# Altium schematic sheet PROM.SchDoc
size Tabloid; SheetNumber: 10; SheetTotal: 25; Sheet_Name: PROM; Size: 11x17
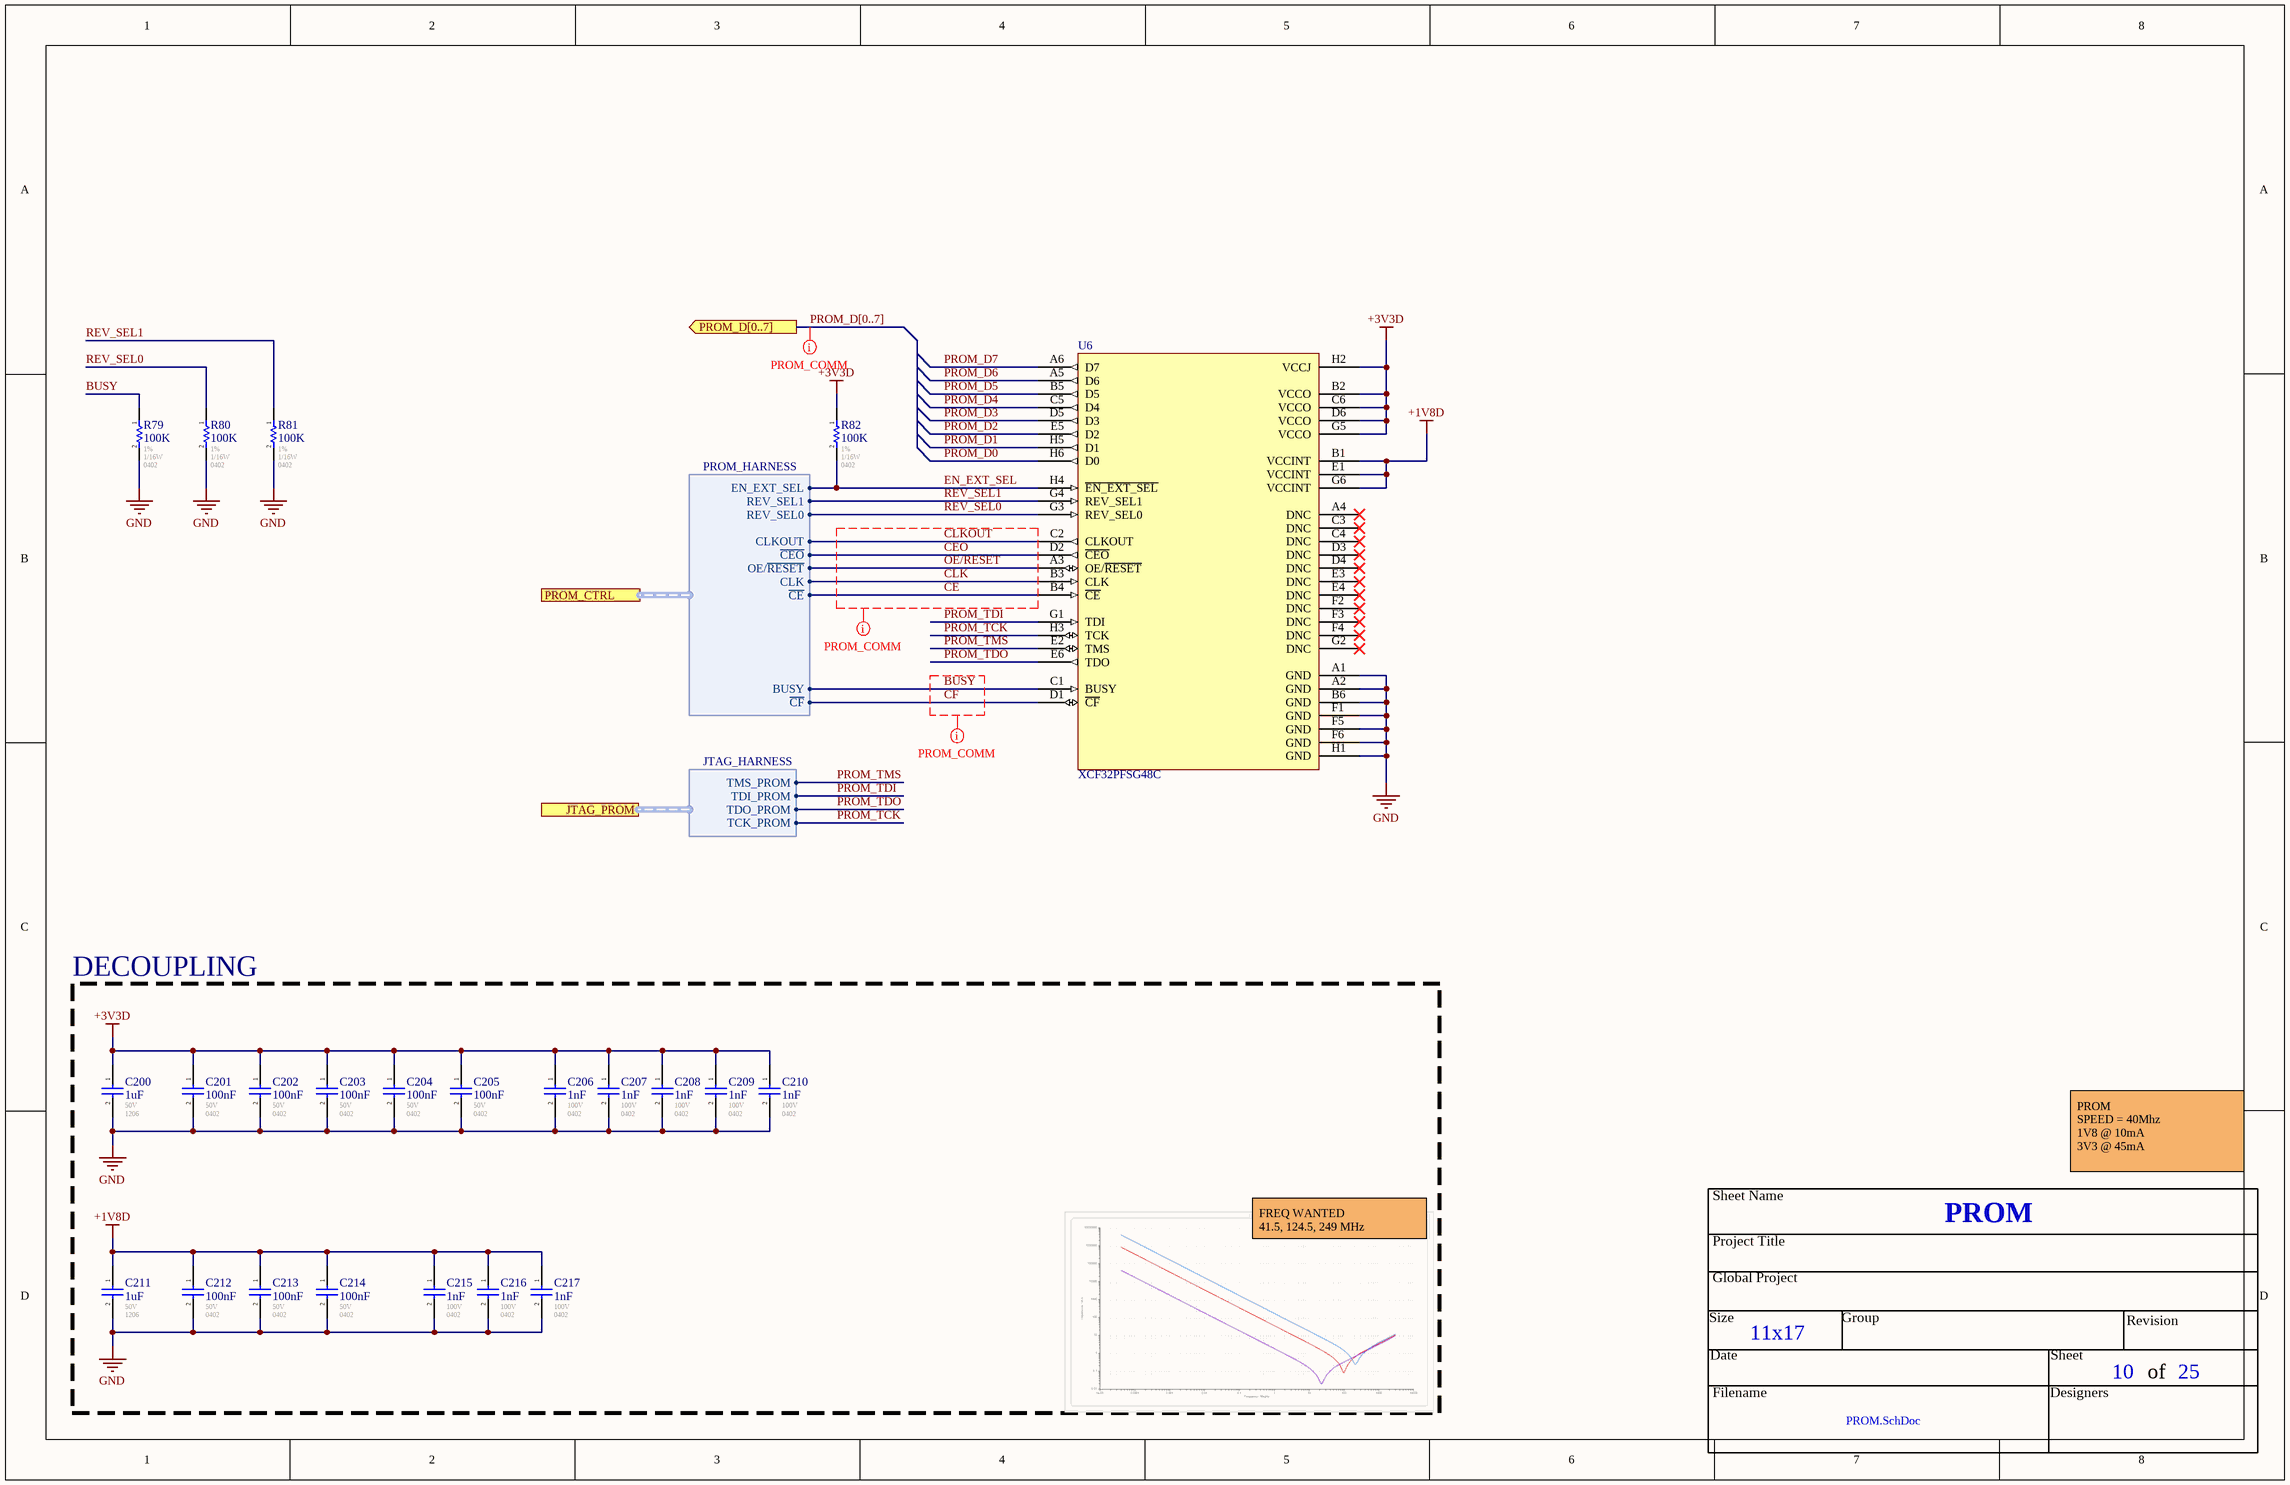
[diagram p0: PROM.SchDoc]

## Parts
C200  1uF  Voltage - Rated: 50V  Footprint: 1206  [CAP_1206]
C201  100nF  Voltage - Rated: 50V  Footprint: 0402  [CAP_0402]
C202  100nF  Voltage - Rated: 50V  Footprint: 0402  [CAP_0402]
C203  100nF  Voltage - Rated: 50V  Footprint: 0402  [CAP_0402]
C204  100nF  Voltage - Rated: 50V  Footprint: 0402  [CAP_0402]
C205  100nF  Voltage - Rated: 50V  Footprint: 0402  [CAP_0402]
C206  1nF  Voltage - Rated: 100V  Footprint: 0402  [CAP_0402]
C207  1nF  Voltage - Rated: 100V  Footprint: 0402  [CAP_0402]
C208  1nF  Voltage - Rated: 100V  Footprint: 0402  [CAP_0402]
C209  1nF  Voltage - Rated: 100V  Footprint: 0402  [CAP_0402]
C210  1nF  Voltage - Rated: 100V  Footprint: 0402  [CAP_0402]
C211  1uF  Voltage - Rated: 50V  Footprint: 1206  [CAP_1206]
C212  100nF  Voltage - Rated: 50V  Footprint: 0402  [CAP_0402]
C213  100nF  Voltage - Rated: 50V  Footprint: 0402  [CAP_0402]
C214  100nF  Voltage - Rated: 50V  Footprint: 0402  [CAP_0402]
C215  1nF  Voltage - Rated: 100V  Footprint: 0402  [CAP_0402]
C216  1nF  Voltage - Rated: 100V  Footprint: 0402  [CAP_0402]
C217  1nF  Voltage - Rated: 100V  Footprint: 0402  [CAP_0402]
R79  100K  Tolerance: 1%  Power: 1/16W  Package / Case: 0402  [RES_0402]
R80  100K  Tolerance: 1%  Power: 1/16W  Package / Case: 0402  [RES_0402]
R81  100K  Tolerance: 1%  Power: 1/16W  Package / Case: 0402  [RES_0402]
R82  100K  Tolerance: 1%  Power: 1/16W  Package / Case: 0402  [RES_0402]
U6  XCF32PFSG48C  [TFBGA-48_0.8MM_8X9]

## Blocks framed on the sheet
DECOUPLING: C200-C217

## Ports
JTAG_PROM (harness JTAG_HARNESS), PROM_CTRL (harness PROM_HARNESS), PROM_D[0..7] (out)

## Harnesses
PROM_HARNESS: EN_EXT_SEL, REV_SEL1, REV_SEL0, CLKOUT, ~{CEO}, OE/~{RESET}, CLK, ~{CE}, BUSY, ~{CF}
JTAG_HARNESS: TCK_PROM, TDO_PROM, TDI_PROM, TMS_PROM

## Nets
+1V8D: C211.1 C212.1 C213.1 C214.1 C215.1 C216.1 C217.1 U6.B1(VCCINT) U6.E1(VCCINT) U6.G6(VCCINT)
+3V3D: C200.1 C201.1 C202.1 C203.1 C204.1 C205.1 C206.1 C207.1 C208.1 C209.1 C210.1 R82.1 U6.B2(VCCO) U6.C6(VCCO) U6.D6(VCCO) U6.G5(VCCO) U6.H2(VCCJ)
GND: C200.2 C201.2 C202.2 C203.2 C204.2 C205.2 C206.2 C207.2 C208.2 C209.2 C210.2 C211.2 C212.2 C213.2 C214.2 C215.2 C216.2 C217.2 R79.2 R80.2 R81.2 U6.A1(GND) U6.A2(GND) U6.B6(GND) U6.F1(GND) U6.F5(GND) U6.F6(GND) U6.H1(GND)
~{CE}: U6.B4(~{CE}) ; port PROM_CTRL.~{CE}
~{CEO}: U6.D2(~{CEO}) ; port PROM_CTRL.~{CEO}
~{CF}: U6.D1(~{CF}) ; port PROM_CTRL.~{CF}
BUSY: R79.1 U6.C1(BUSY) ; port PROM_CTRL.BUSY
CLK: U6.B3(CLK) ; port PROM_CTRL.CLK
CLKOUT: U6.C2(CLKOUT) ; port PROM_CTRL.CLKOUT
EN_EXT_SEL: R82.2 U6.H4(~{EN_EXT_SEL}) ; port PROM_CTRL.EN_EXT_SEL
OE/RESET: U6.A3(OE/~{RESET}) ; port PROM_CTRL.OE/~{RESET}
PROM_D0: U6.H6(D0)
PROM_D1: U6.H5(D1)
PROM_D2: U6.E5(D2)
PROM_D3: U6.D5(D3)
PROM_D4: U6.C5(D4)
PROM_D5: U6.B5(D5)
PROM_D6: U6.A5(D6)
PROM_D7: U6.A6(D7)
PROM_TCK: U6.H3(TCK) ; port JTAG_PROM.TCK_PROM
PROM_TDI: U6.G1(TDI) ; port JTAG_PROM.TDI_PROM
PROM_TDO: U6.E6(TDO) ; port JTAG_PROM.TDO_PROM
PROM_TMS: U6.E2(TMS) ; port JTAG_PROM.TMS_PROM
REV_SEL0: R80.1 U6.G3(REV_SEL0) ; port PROM_CTRL.REV_SEL0
REV_SEL1: R81.1 U6.G4(REV_SEL1) ; port PROM_CTRL.REV_SEL1

Not connected (* = marked no-connect by the designer): U6 A4(DNC)* C3(DNC)* C4(DNC)* D3(DNC)* D4(DNC)* E3(DNC)* E4(DNC)* F2(DNC)* F3(DNC)* F4(DNC)* G2(DNC)*

## Buses and harness runs
bus PROM_D[0..7] = port PROM_D[0..7]

## Layout directives
net class PROM_COMM: (no net found under the mark), BUSY, CLK, CLKOUT, OE/RESET, ~{CEO}, ~{CE}, ~{CF}

## Notes on the sheet
- PROM
  SPEED = 40Mhz
  1V8 @ 10mA
  3V3 @ 45mA
- FREQ WANTED
  41.5, 124.5, 249 MHz
- Sheet Name
- Project Title
- Global Project
- Revision
- Size
- Date
- Group
- Sheet
- of
- Filename
- Designers

## Library data of the parts
C200 C211 = CAP_CER: GCJ31CR71H105KA12L / 1206 1uF 10% X7R Ceramic Capacitor; Mfr: Murata; Operating Temperature: -55C - 125C; Temperature Coefficient: X7R; ComponentLink1Description: Digikey; ComponentLink1URL: [Digikey Link]; Part#: GCJ31CR71H105KA12L; ComponentLink2Description: Datasheet; ComponentLink2URL: [Datasheet Link]; Tolerance: 10%; Ratings: AEC-Q200
C201-C205 C212-C214 = CAP_CER: GCM155R71H104KE02J / 0402 100nF 10% X7R Ceramic Capacitor; Mfr: Murata; Operating Temperature: -55C - 125C; Temperature Coefficient: X7R; ComponentLink1Description: Digikey; ComponentLink1URL: [Digikey Link]; Part#: GCM155R71H104KE02J; ComponentLink2Description: Datasheet; ComponentLink2URL: [Datasheet Link]; Tolerance: 10%; Ratings: AEC-Q200
C206-C210 C215-C217 = CAP_CER: GCM155R72A102KA37D / 0402 1nF 10% X7R Ceramic Capacitor; Mfr: Murata; Operating Temperature: -55C - 125C; Temperature Coefficient: X7R; ComponentLink1Description: Digikey; ComponentLink1URL: [Digikey Link]; Part#: GCM155R72A102KA37D; ComponentLink2Description: Datasheet; ComponentLink2URL: [Datasheet Link]; Tolerance: 10%; Ratings: AEC-Q200
R79-R82 = RESISTOR: Automotive: AEC-Q200; Operating Temperature: *; # Digikey: *; ComponentLink1Description: Digikey; ComponentLink1URL: *; # Manufacturer: *
U6 = XCF32PFSG48C: IC PROM SRL/PAR 1.8V 32M 48CSBGA; Mfr: Xilinx; Memory Size: 32Mb; Voltage - Suply: 1.65V - 2V; Part#: XCF32PFSG48C; Operating Temperature: -40C - 85C; ComponentLink1Description: Digikey; ComponentLink1URL: https://www.digikey.ca/en/products/detail/amd/XCF32PFSG48C/966638; ComponentLink2Description: Octopart; ComponentLink2URL: https://octopart.com/xcf32pfsg48c-xilinx-429660